# EAGLE schematic untitled (EAGLE 9.6.2)
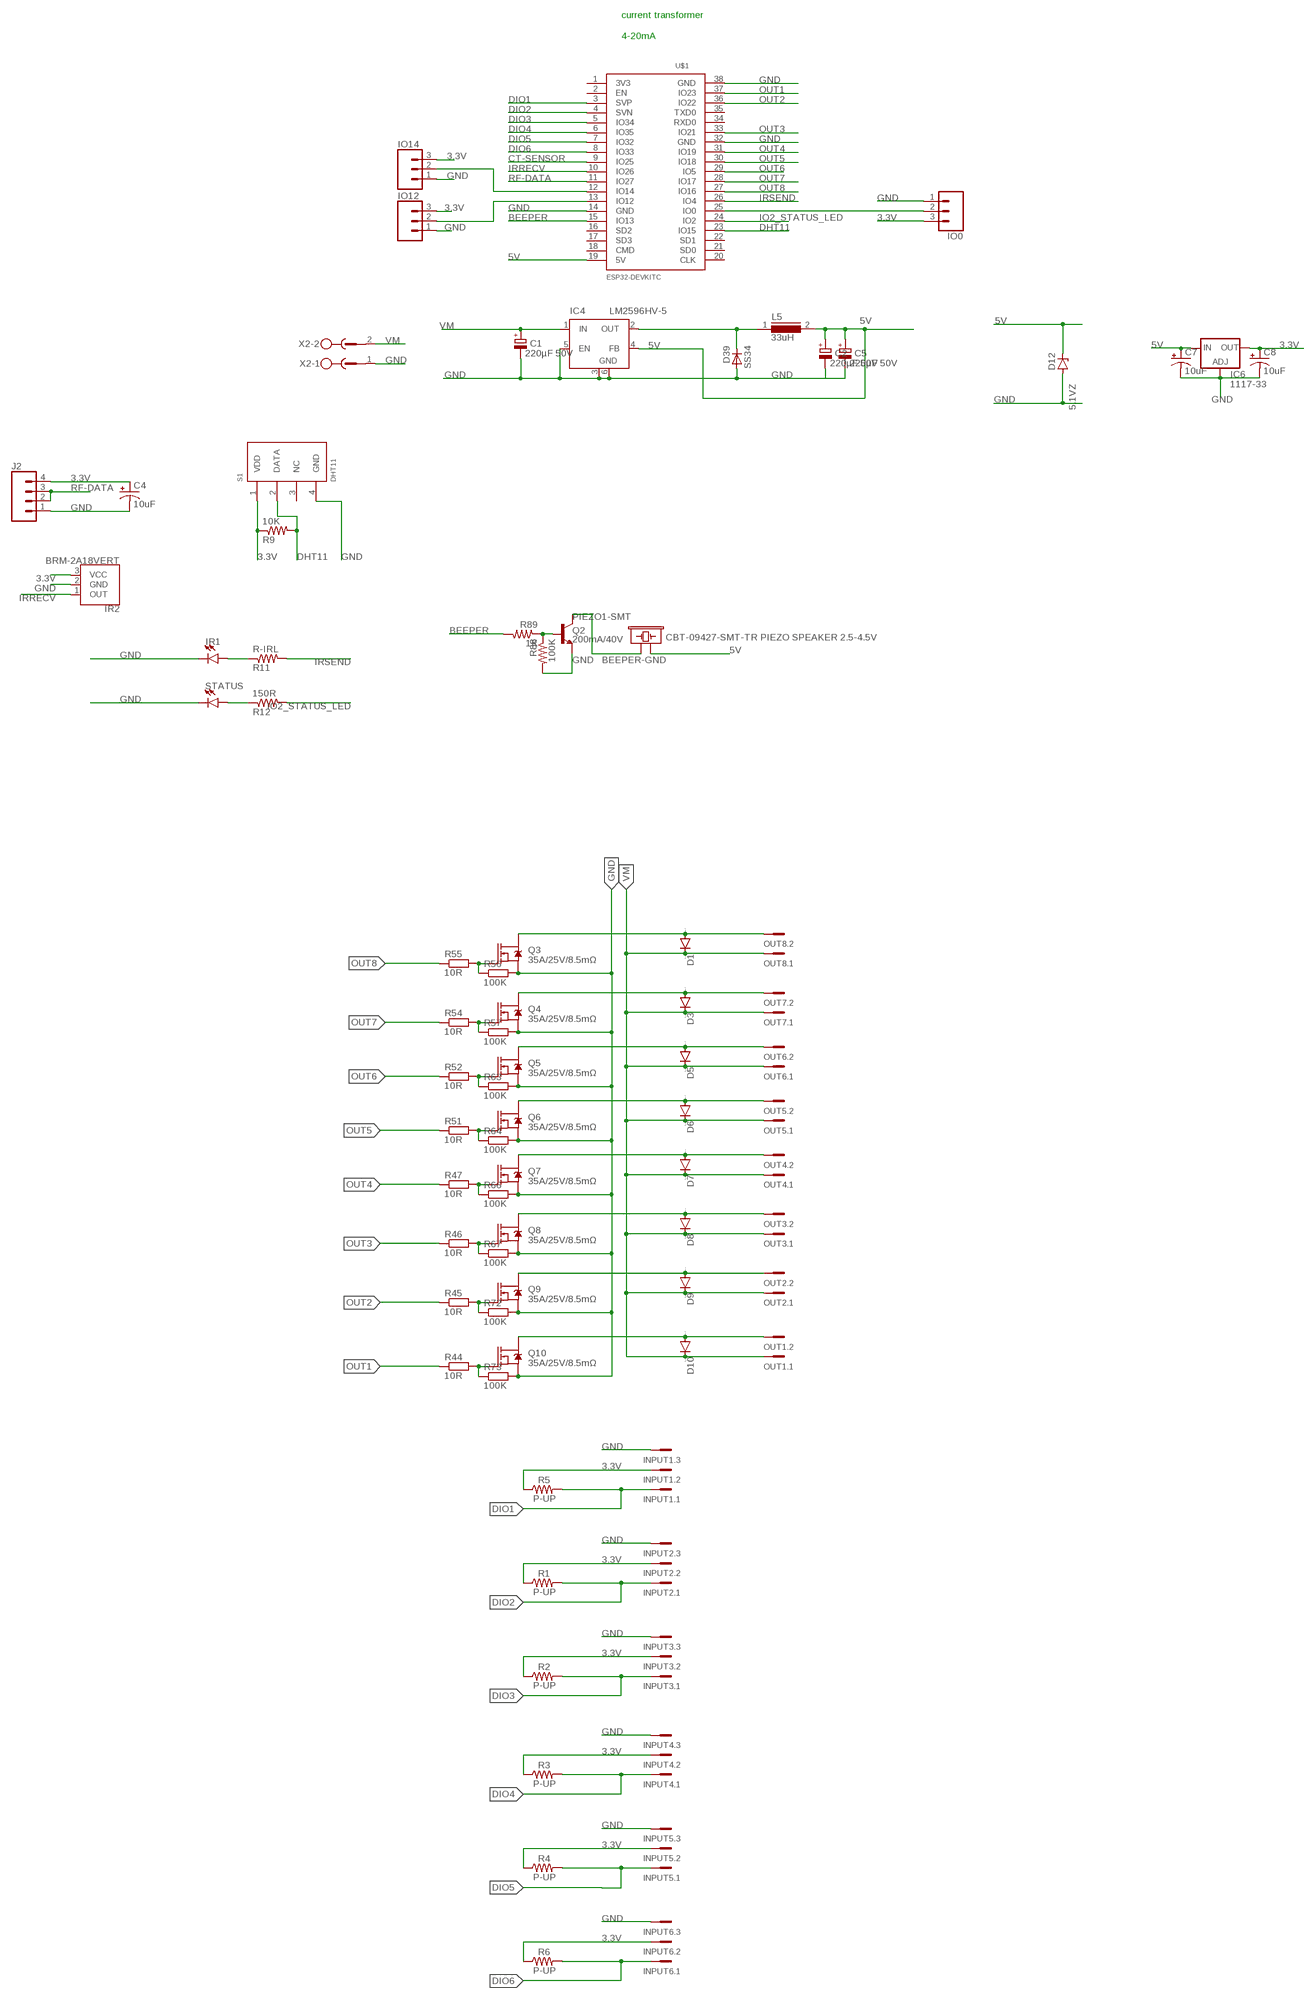
[diagram p0: schematic, sheet 1]

## Parts
C1  220µF 50V  CPOL-EUE3.5-8  [E3,5-8]
C2  220µF 50V  CPOL-EUE3.5-8  [E3,5-8]
C4  10uF  CAP_POLPTH2  [CPOL-RADIAL-10UF-25V]
C5  220µF 50V  CPOL-EUE3.5-8  [E3,5-8]
C7  10uF  CAP_POLPTH2  [CPOL-RADIAL-10UF-25V]
C8  10uF  CAP_POLPTH2  [CPOL-RADIAL-10UF-25V]
D1  1N4148DO35-7  [DO35-7]
D3  1N4148DO35-7  [DO35-7]
D5  1N4148DO35-7  [DO35-7]
D6  1N4148DO35-7  [DO35-7]
D7  1N4148DO35-7  [DO35-7]
D8  1N4148DO35-7  [DO35-7]
D9  1N4148DO35-7  [DO35-7]
D10  1N4148DO35-7  [DO35-7]
D12  5.1VZ  ZENER-DIODESMB  [SMB]
D39  SS34  D-SOD-87  [SOD87]
IC4  LM2596HV-5  LM2596S  [TO263-5]
IC6  1117-33  LD117AS33TR  [SOT223]
INPUT1  MCV3  [MCV3]
INPUT2  MCV3  [MCV3]
INPUT3  MCV3  [MCV3]
INPUT4  MCV3  [MCV3]
INPUT5  MCV3  [MCV3]
INPUT6  MCV3  [MCV3]
IO0  CONN_03LOCK  [1X03_LOCK]
IO12  CONN_03LOCK  [1X03_LOCK]
IO14  CONN_03LOCK  [1X03_LOCK]
IR1  LED3MM  [LED_3MM]
IR2  BRM-2A18VERT  [BRM-2508_VERT]
J2  CONN_04LOCK  [1X04_LOCK]
L5  33uH  DR127  [DR127]
OUT1  MCV2  [MCV2]
OUT2  MCV2  [MCV2]
OUT3  MCV2  [MCV2]
OUT4  MCV2  [MCV2]
OUT5  MCV2  [MCV2]
OUT6  MCV2  [MCV2]
OUT7  MCV2  [MCV2]
OUT8  MCV2  [MCV2]
PIEZO1-SMT  CBT-09427-SMT-TR PIEZO SPEAKER 2.5-4.5V  BUZZER-PTH  [BUZZER-12MM]
Q2  200mA/40V  TRANS_NPN-2N3904  [TO-92]
Q3  35A/25V/8.5mΩ  MOSFET-NCH-FDD8780  [DPAK]
Q4  35A/25V/8.5mΩ  MOSFET-NCH-FDD8780  [DPAK]
Q5  35A/25V/8.5mΩ  MOSFET-NCH-FDD8780  [DPAK]
Q6  35A/25V/8.5mΩ  MOSFET-NCH-FDD8780  [DPAK]
Q7  35A/25V/8.5mΩ  MOSFET-NCH-FDD8780  [DPAK]
Q8  35A/25V/8.5mΩ  MOSFET-NCH-FDD8780  [DPAK]
Q9  35A/25V/8.5mΩ  MOSFET-NCH-FDD8780  [DPAK]
Q10  35A/25V/8.5mΩ  MOSFET-NCH-FDD8780  [DPAK]
R1  P-UP  R-US_0204/7  [0204/7]
R2  P-UP  R-US_0204/7  [0204/7]
R3  P-UP  R-US_0204/7  [0204/7]
R4  P-UP  R-US_0204/7  [0204/7]
R5  P-UP  R-US_0204/7  [0204/7]
R6  P-UP  R-US_0204/7  [0204/7]
R9  10K  R-US_0204/7  [0204/7]
R11  R-IRL  R-US_0204/7  [0204/7]
R12  150R  R-US_0204/7  [0204/7]
R44  10R  R-EU_0204/7  [0204/7]
R45  10R  R-EU_0204/7  [0204/7]
R46  10R  R-EU_0204/7  [0204/7]
R47  10R  R-EU_0204/7  [0204/7]
R51  10R  R-EU_0204/7  [0204/7]
R52  10R  R-EU_0204/7  [0204/7]
R54  10R  R-EU_0204/7  [0204/7]
R55  10R  R-EU_0204/7  [0204/7]
R56  100K  R-EU_0204/7  [0204/7]
R57  100K  R-EU_0204/7  [0204/7]
R63  100K  R-EU_0204/7  [0204/7]
R64  100K  R-EU_0204/7  [0204/7]
R66  100K  R-EU_0204/7  [0204/7]
R67  100K  R-EU_0204/7  [0204/7]
R72  100K  R-EU_0204/7  [0204/7]
R73  100K  R-EU_0204/7  [0204/7]
R88  100K  R-US_0204/7  [0204/7]
R89  1K  R-US_0204/7  [0204/7]
S1  DHT11  [DHT11]
STATUS  LED3MM  [LED_3MM]
U$1  ESP32NODEMCU  [ESP32NODEMCU]
X2  MSTBV2  [MSTBV2]

## Nets
3.3V: C4.1(+) C8.1(+) IC6.4(OUT) INPUT1.2 INPUT2.2 INPUT3.2 INPUT4.2 INPUT5.2 INPUT6.2 IO0.3 IO12.3 IO14.3 IR2.3(VCC) J2.4 R1.1 R2.1 R3.1 R4.1 R5.1 R6.1 R9.1 S1.1(VDD)
5V: C2.+ C5.+ C7.1(+) D12.C IC4.4(FB) IC6.3(IN) L5.2 PIEZO1-SMT.+ U$1.19(5V)
BEEPER: R89.2 U$1.15(IO13)
BEEPER-GND: PIEZO1-SMT.- Q2.3(C)
CT-SENSOR: U$1.9(IO25)
DHT11: R9.2 S1.2(DATA) U$1.23(IO15)
DIO1: INPUT1.1 R5.2 U$1.3(SVP)
DIO2: INPUT2.1 R1.2 U$1.4(SVN)
DIO3: INPUT3.1 R2.2 U$1.5(IO34)
DIO4: INPUT4.1 R3.2 U$1.6(IO35)
DIO5: INPUT5.1 R4.2 U$1.7(IO32)
DIO6: INPUT6.1 R6.2 U$1.8(IO33)
GND: C1.- C2.- C4.2(-) C5.- C7.2(-) C8.2(-) D12.A D39.2(A) IC4.3(GND) IC4.5(EN) IC4.6(GND) IC6.1(ADJ) INPUT1.3 INPUT2.3 INPUT3.3 INPUT4.3 INPUT5.3 INPUT6.3 IO0.1 IO12.1 IO14.1 IR1.K(C) IR2.2(GND) J2.1 Q2.1(E) Q3.3(S) Q4.3(S) Q5.3(S) Q6.3(S) Q7.3(S) Q8.3(S) Q9.3(S) Q10.3(S) R56.2 R57.2 R63.2 R64.2 R66.2 R67.2 R72.2 R73.2 R88.2 S1.4(GND) STATUS.K(C) U$1.14(GND) U$1.32(GND) U$1.38(GND) X2.1
IO2_STATUS_LED: R12.2 U$1.24(IO2)
IRRECV: IR2.1(OUT) U$1.10(IO26)
IRSEND: R11.2 U$1.26(IO4)
N$1: R12.1 STATUS.A
N$2: IO0.2 U$1.25(IO0)
N$3: IO12.2 U$1.13(IO12)
N$4: IO14.2 U$1.12(IO14)
N$7: D9.A OUT2.2 Q9.4(D)
N$8: IR1.A R11.1
N$11: Q2.2(B) R88.1 R89.1
N$16: Q10.1(G) R44.2 R73.1
N$18: Q9.1(G) R45.2 R72.1
N$19: Q8.1(G) R46.2 R67.1
N$23: Q7.1(G) R47.2 R66.1
N$27: Q6.1(G) R51.2 R64.1
N$31: Q5.1(G) R52.2 R63.1
N$35: Q4.1(G) R54.2 R57.1
N$37: Q3.1(G) R55.2 R56.1
N$41: D1.A OUT8.2 Q3.4(D)
N$42: D3.A OUT7.2 Q4.4(D)
N$43: D5.A OUT6.2 Q5.4(D)
N$44: D6.A OUT5.2 Q6.4(D)
N$45: D7.A OUT4.2 Q7.4(D)
N$46: D10.A OUT1.2 Q10.4(D)
N$47: D8.A OUT3.2 Q8.4(D)
N$164: D39.1(C) IC4.2(OUT) L5.1
OUT1: R44.1 U$1.37(IO23)
OUT2: R45.1 U$1.36(IO22)
OUT3: R46.1 U$1.33(IO21)
OUT4: R47.1 U$1.31(IO19)
OUT5: R51.1 U$1.30(IO18)
OUT6: R52.1 U$1.29(IO5)
OUT7: R54.1 U$1.28(IO17)
OUT8: R55.1 U$1.27(IO16)
RF-DATA: J2.2 J2.3 U$1.11(IO27)
VM: C1.+ D1.C D3.C D5.C D6.C D7.C D8.C D9.C D10.C IC4.1(IN) OUT1.1 OUT2.1 OUT3.1 OUT4.1 OUT5.1 OUT6.1 OUT7.1 OUT8.1 X2.2
Unconnected: S1.3(NC) U$1.1(3V3) U$1.2(EN) U$1.16(SD2) U$1.17(SD3) U$1.18(CMD) U$1.20(CLK) U$1.21(SD0) U$1.22(SD1) U$1.34(RXD0) U$1.35(TXD0)

## Notes on the sheet
- current transformer
  
  4-20mA

## Library data of the parts
C1 C2 C5 = resistor:CPOL-EU: POLARIZED CAPACITOR, European symbol
C4 C7 C8 = SparkFun:CAP_POL: Capacitor Polarized These are standard SMD and PTH capacitors. Normally 10uF, 47uF, and 100uF in electrolytic and tantalum varieties. Always verify the external diameter of the through hole cap, it varies with capacity, voltage, and manufacturer. The EIA devices should be standard.
D1 D3 D5-D10 = diode:1N4148: DIODE high speed (Philips)
D12 = diode:ZENER-DIODE: Z-Diode
D39 = semicon-smd-ipc:D-: DIODE unfilled
IC4 = linear:LM2596S: STEP-DOWN VOLTAGE REGULATOR
IC6 = v-reg:LD117A?*: Low drop fixed and adjustable positive voltage regulators 1 A Source: http://www.st.com/stonline/products/literature/ds/7194/ld1117axx.pdf
INPUT1-INPUT6 = con-phoenix-381_l:MCV3: Mini-Combicon 3.81mm vertikal 3polig MCV 1,5/3-G-3,81 Artikel-Nr. 1803439
IO0 IO12 IO14 = SparkFun-Connectors:CONN_03: Multi connection point. Often used as Generic Header-pin footprint for 0.1 inch spaced/style header connections On any of the 0.1 inch spaced packages, you can populate with these: Break Away Headers - Straight <https://www.sparkfun.com/products/116> (PRT-00116) Break Away Male Headers - Right Angle <https://www.sparkfun.com/products/553> (PRT-00553) Female Headers <https://www.sparkfun.com/products/115> (PRT-00115) Break Away Headers - Machine Pin <https://www.sparkfun.com/products/117> (PRT-00117) Break Away Female Headers - Swiss Machine Pin <https://www.sparkfun.com/products/743> (PRT-00743) Stackable Header - 3 Pin (Female, 0.1") <https://www.sparkfun.com/products/13875> (PRT-13875) For SCREWTERMINALS and SPRING TERMINALS visit here: Screw Terimnals on SparkFun.com <https://www.sparkfun.com/search/results?term=Screw+Terminals> (5mm/3.5mm/2.54mm spacing) This device is also useful as a general connection point to wire up your design to another part of your project. Our various solder wires solder well into these plated through hole pads. Hook-Up Wire - Assortment (Stranded, 22 AWG) <https://www.sparkfun.com/products/11375> (PRT-11375) Hook-Up Wire - Assortment (Solid Core, 22 AWG) <https://www.sparkfun.com/products/11367> (PRT-11367) View the entire wire category on our website here <https://www.sparkfun.com/categories/141> Special notes: Molex polarized connector foot print use with SKU : PRT-08232 with associated crimp pins and housings.
IR1 STATUS = SparkFun-LED:LED: LED (Generic) Standard schematic elements and footprints for 5mm, 3mm, 1206, and 0603 sized LEDs. Generic LEDs with no color specified.; PROD_ID: DIO-08794
IR2 = SparkFun-Sensors:BRM-2A18: BRM-2A18 IR Receiver The BRM-2A18 is miniaturized infrared receiver for remote control and other applications requiring improved ambient light rejection. Vertical package is a primary component on the ZX Distance and Gesture Sensor. RA package is not currently in-use. Example Datasheet <http://www.sinoskysun.com/upload/20110512/201105120447164615.PDF> SparkFun Products ZX Distance and Gesture Sensor <https://www.sparkfun.com/products/12780> (COM-12780); PROD_ID: COMP-12505
J2 = SparkFun-Connectors:CONN_04: Multi connection point. Often used as Generic Header-pin footprint for 0.1 inch spaced/style header connections On any of the 0.1 inch spaced packages, you can populate with these: Break Away Headers - Straight <https://www.sparkfun.com/products/116> (PRT-00116) Break Away Male Headers - Right Angle <https://www.sparkfun.com/products/553> (PRT-00553) Female Headers <https://www.sparkfun.com/products/115> (PRT-00115) Break Away Headers - Machine Pin <https://www.sparkfun.com/products/117> (PRT-00117) Break Away Female Headers - Swiss Machine Pin <https://www.sparkfun.com/products/743> (PRT-00743) For SCREWTERMINALS and SPRING TERMINALS visit here: Screw Terimnals on SparkFun.com <https://www.sparkfun.com/search/results?term=Screw+Terminals> (5mm/3.5mm/2.54mm spacing) This device is also useful as a general connection point to wire up your design to another part of your project. Our various solder wires solder well into these plated through hole pads. Hook-Up Wire - Assortment (Stranded, 22 AWG) <https://www.sparkfun.com/products/11375> (PRT-11375) Hook-Up Wire - Assortment (Solid Core, 22 AWG) <https://www.sparkfun.com/products/11367> (PRT-11367) View the entire wire category on our website here <https://www.sparkfun.com/categories/141> Special notes: Molex polarized connector foot print use with SKU : PRT-08231 with associated crimp pins and housings. 1MM SMD Version SKU: PRT-10208; PROD_ID: CONN-09696
L5 = inductors:DR127: High Power Density, High Efficiency, Shielded Inductors Source: coiltronics_dr_series.pdf
OUT1-OUT8 = con-phoenix-381_l:MCV2: Mini-Combicon 3.81mm vertikal 2polig MCV 1,5/2-G-3,81 Artikel-Nr. 1803426
PIEZO1-SMT = SparkFun-Electromechanical:BUZZER: Buzzer Small round buzzers that operate around the audible 2kHz range. You can use these as speakers to create simple music or user interfaces. Variant Overview: PTH - Mini Speaker - PC Mount 12mm 2.048kHz <https://www.sparkfun.com/products/7950> PTH_KIT - Mini Speaker - PC Mount 12mm 2.048kHz <https://www.sparkfun.com/products/7950> KIT simplifies soldering by adding stop mask to one side of the pads. PTH_NO_SILK - Mini Speaker - PC Mount 12mm 2.048kHz <https://www.sparkfun.com/products/7950> No silkscreen indicator of buzzer outline. PTH_KIT_NO_SILK - Mini Speaker - PC Mount 12mm 2.048kHz <https://www.sparkfun.com/products/7950> KIT package w/o silkscreen SMD - Buzzer Audio Magnetic (CCV-084B16) SMD buzzer used on, e.g. the LilyPad Buzzer <https://www.sparkfun.com/products/8463> and RFID USB Reader <https://www.sparkfun.com/products/9963>. SMD_KIT - Buzzer Audio Magnetic (CCV-084B16) SMD Buzzer with elongated pins to make soldering easier. Used on the SparkFun Simon Says - Surface Mount Soldering Kit <https://www.sparkfun.com/products/10935>.; PROD_ID: COMP-08253; SF_SKU: COM-07950
Q2 = SparkFun-DiscreteSemi:TRANS_NPN: NPN transistor Current controlled devices typically used to amplify current or used as a switch. BC547 - COM-08928 <http://www.sparkfun.com/products/8928> (TO-92 45V 100mA) (1.Collector 2.Base 3.Emitter) 2N3904 - COM-00521 <http://www.sparkfun.com/products/521> (TO-92 40V 200mA) (1.Emitter 2.Base 3.Collector) P2N2222A - COM-12852 <http://www.sparkfun.com/products/12852> (TO-92 40V 600mA) (1.Collector 2.Base 3.Emitter); PROD_ID: TRANS-08447
Q3-Q10 = SparkFun-DiscreteSemi:MOSFET-NCH: N-channel MOSFETs Voltage controlled devices that allow control of high current outputs. SparkFun Products: SparkFun OpenScale <https://www.sparkfun.com/products/13261> SparkFun Digital Sandbox <https://www.sparkfun.com/products/12651> SparkFun Monster Moto Shield <https://www.sparkfun.com/products/10182> SparkFun MOSFET Power Controller <https://www.sparkfun.com/products/11214>; PROD_ID: TRANS-09984
R1-R6 = resistor:R-US_: RESISTOR, American symbol
R9 R11 R12 R88 R89 = adafruit:R-US_: RESISTOR, American symbol
R44-R47 R51 R52 R54-R57 R63 R64 R66 R67 R72 R73 = rcl:R-EU_: RESISTOR, European symbol; SPICEPREFIX: R
S1 = dht:DHT11
U$1 = ESP32-NODEMCU:ESP32NODEMCU
X2 = con-phoenix-500:MSTBV2: PHOENIX; OC_FARNELL: unknown; OC_NEWARK: unknown

## Net classes
0 default: width 0.203 mm, clearance 0.152 mm